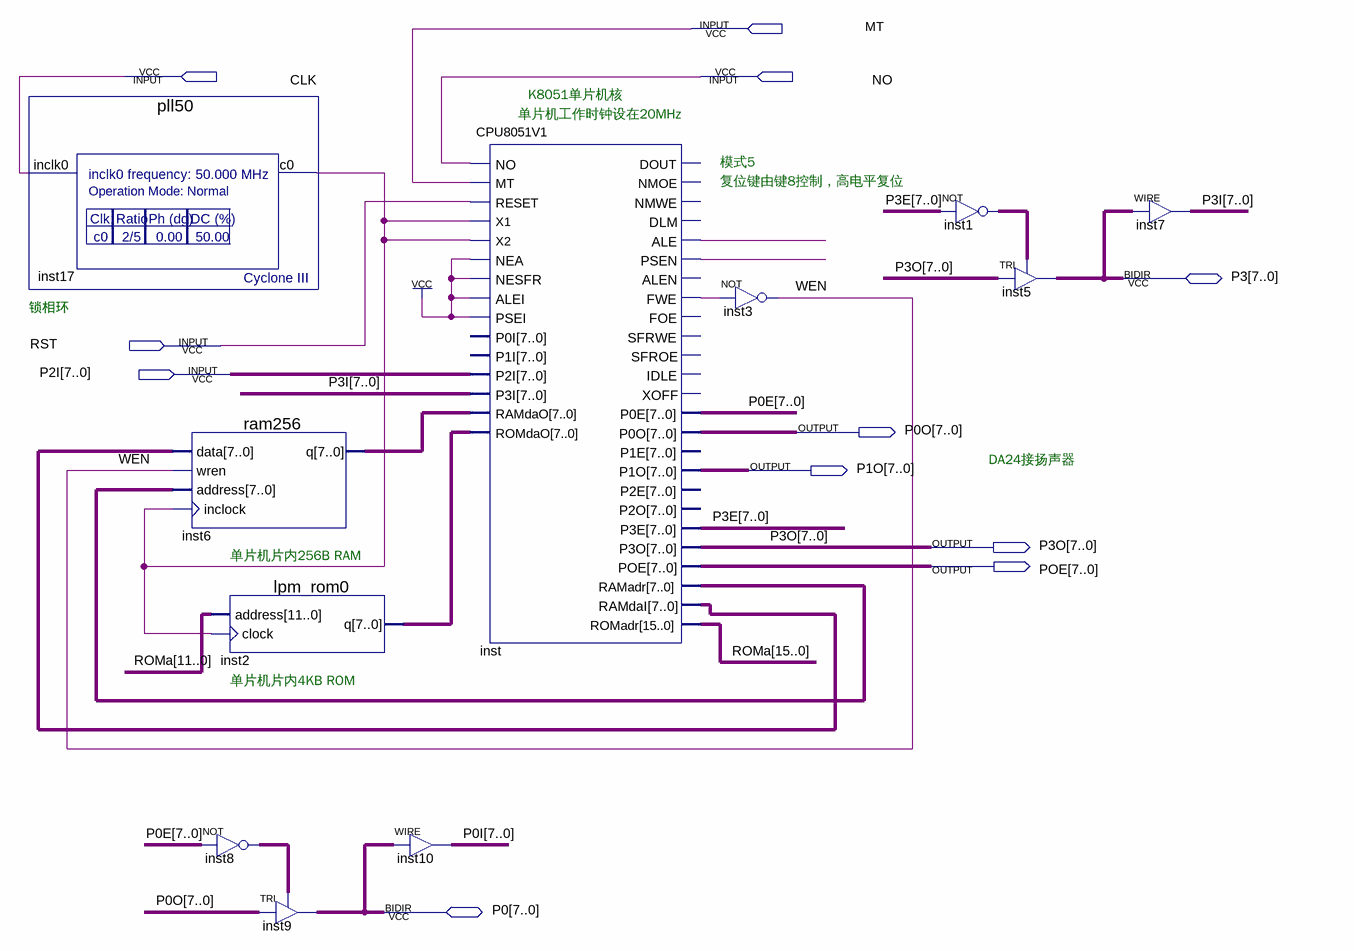
[diagram p0: schematic sheet]
// Quartus schematic MCU8951.bdf as structural Verilog: 11 symbols, 11 pins
module MCU8951 (
  input  MT,
  input  CLK,
  input  NO,
  input  RST,
  input  [7:0] P2I,
  inout  [7:0] P3,
  inout  [7:0] P0,
  output [7:0] P0O,
  output [7:0] P1O,
  output [7:0] P3O,
  output [7:0] POE
);

  wire inst17_c0, inst_ale, inst_fwe, inst_psen, WEN;
  wire [7:0] inst1_out, inst2_q, inst6_q, inst8_out, inst_ramadr, inst_ramdai, P0E, P0I, P3E, P3I;
  wire [15:0] ROMa;

  pll50 inst17 (.inclk0(CLK), .c0(inst17_c0));
  ram256 inst6 (.data(inst_ramdai), .wren(WEN), .address(inst_ramadr), .inclock(inst17_c0), .q(inst6_q));
  lpm_rom0 inst2 (.address(ROMa[11:0]), .clock(inst17_c0), .q(inst2_q));
  assign inst8_out = ~P0E;  // NOT inst8, 8 bits wide
  TRI inst9[7:0] (.IN(P0O), .OE(inst8_out), .OUT(P0));
  assign P0I = P0;  // WIRE inst10
  CPU8051V1 inst (
    .NO(NO), .MT(MT), .RESET(RST), .X1(inst17_c0), .X2(inst17_c0), .NEA(1'b1), .NESFR(1'b1), .ALEI(1'b1),
    .PSEI(1'b1), .P2I(P2I), .P3I(P3I), .RAMdaO(inst6_q), .ROMdaO(inst2_q), .ALE(inst_ale), .PSEN(inst_psen),
    .FWE(inst_fwe), .P0E(P0E), .P0O(P0O), .P1O(P1O), .P3E(P3E), .P3O(P3O), .POE(POE), .RAMadr(inst_ramadr),
    .RAMdaI(inst_ramdai), .ROMadr(ROMa));  // open: P0I, P1I, DOUT, NMOE, NMWE, DLM, ALEN, FOE, SFRWE, SFROE, IDLE, XOFF, P1E, P2E, P2O
  not inst3 (WEN, inst_fwe);
  assign inst1_out = ~P3E;  // NOT inst1, 8 bits wide
  TRI inst5[7:0] (.IN(P3O), .OE(inst1_out), .OUT(P3));
  assign P3I = P3;  // WIRE inst7

  // Notes on the sheet:
  //   K8051单片机核
  //   单片机工作时钟设在20MHz
  //   模式5
  //   复位键由键8控制，高电平复位
  //   锁相环
  //   DA24接扬声器
  //   单片机片内256B RAM
  //   单片机片内4KB ROM
endmodule
